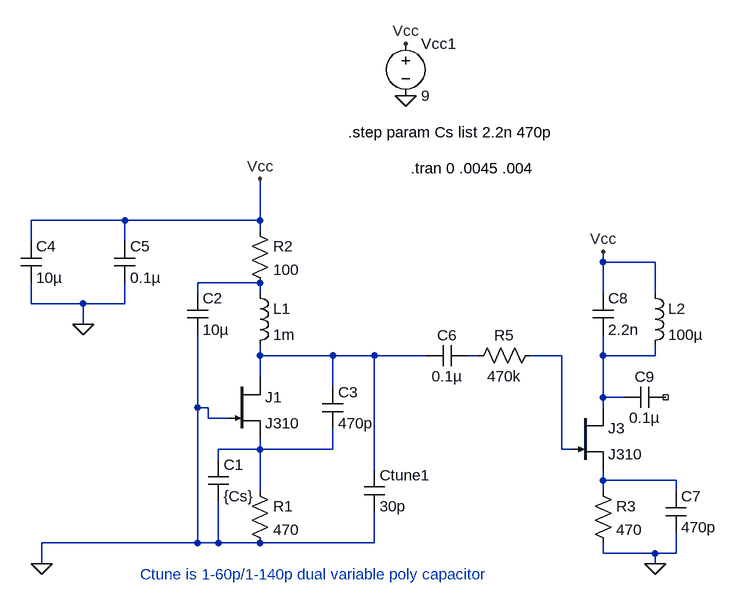
[diagram p0: schematic OscillatorToFix.asc]
OscillatorToFix.asc, the LTspice schematic file:
Version 4
SHEET 1 880 680
WIRE -128 16 -272 16
WIRE 80 16 80 -48
WIRE 80 16 -128 16
WIRE 80 32 80 16
WIRE -272 48 -272 16
WIRE -128 48 -128 16
WIRE 608 80 608 64
WIRE 688 80 608 80
WIRE 80 112 -16 112
WIRE -16 128 -16 112
WIRE 80 128 80 112
WIRE 608 128 608 80
WIRE 688 128 688 80
WIRE -272 144 -272 112
WIRE -192 144 -272 144
WIRE -128 144 -128 112
WIRE -128 144 -192 144
WIRE -192 176 -192 144
WIRE 80 224 80 208
WIRE 192 224 80 224
WIRE 256 224 192 224
WIRE 336 224 256 224
WIRE 416 224 400 224
WIRE 544 224 496 224
WIRE 608 224 608 192
WIRE 688 224 688 208
WIRE 688 224 608 224
WIRE 80 256 80 224
WIRE 192 272 192 224
WIRE 608 288 608 224
WIRE 640 288 608 288
WIRE -16 304 -16 192
WIRE 0 304 -16 304
WIRE 608 304 608 288
WIRE 0 320 0 304
WIRE 32 320 0 320
WIRE 80 368 80 352
WIRE 80 368 16 368
WIRE 192 368 192 336
WIRE 192 368 80 368
WIRE 544 368 544 224
WIRE 560 368 544 368
WIRE 16 384 16 368
WIRE 256 400 256 224
WIRE 608 416 608 400
WIRE 720 416 608 416
WIRE 80 432 80 368
WIRE 608 432 608 416
WIRE 720 432 720 416
WIRE -16 512 -16 304
WIRE -16 512 -256 512
WIRE 16 512 16 448
WIRE 16 512 -16 512
WIRE 80 512 16 512
WIRE 256 512 256 464
WIRE 256 512 80 512
WIRE 608 528 608 512
WIRE 688 528 608 528
WIRE 720 528 720 496
WIRE 720 528 688 528
WIRE -256 544 -256 512
WIRE 688 544 688 528
FLAG 304 -176 0
FLAG 304 -256 Vcc
FLAG 80 -48 Vcc
FLAG -256 544 0
FLAG -192 176 0
FLAG 688 544 0
FLAG 608 64 Vcc
SYMBOL voltage 304 -272 R0
WINDOW 123 0 0 Left 0
WINDOW 39 0 0 Left 0
SYMATTR InstName Vcc1
SYMATTR Value 9
SYMBOL res 64 416 R0
SYMATTR InstName R1
SYMATTR Value 470
SYMBOL cap 0 384 R0
SYMATTR InstName C1
SYMATTR Value {Cs}
SYMBOL cap -32 128 R0
SYMATTR InstName C2
SYMATTR Value 10µ
SYMBOL njf 32 256 R0
SYMATTR InstName J1
SYMATTR Value J310
SYMBOL ind 64 112 R0
SYMATTR InstName L1
SYMATTR Value 1m
SYMBOL res 64 16 R0
SYMATTR InstName R2
SYMATTR Value 100
SYMBOL cap 176 272 R0
SYMATTR InstName C3
SYMATTR Value 470p
SYMBOL cap 240 400 R0
SYMATTR InstName Ctune1
SYMATTR Value 30p
SYMBOL cap -288 48 R0
SYMATTR InstName C4
SYMATTR Value 10µ
SYMBOL cap -144 48 R0
SYMATTR InstName C5
SYMATTR Value 0.1µ
SYMBOL cap 400 208 R90
WINDOW 0 0 32 VBottom 2
WINDOW 3 32 32 VTop 2
SYMATTR InstName C6
SYMATTR Value 0.1µ
SYMBOL njf 560 304 R0
SYMATTR InstName J3
SYMATTR Value J310
SYMBOL res 592 416 R0
SYMATTR InstName R3
SYMATTR Value 470
SYMBOL cap 704 432 R0
SYMATTR InstName C7
SYMATTR Value 470p
SYMBOL cap 592 128 R0
SYMATTR InstName C8
SYMATTR Value 2.2n
SYMBOL ind 672 112 R0
SYMATTR InstName L2
SYMATTR Value 100µ
SYMBOL cap 704 272 R90
WINDOW 0 0 32 VBottom 2
WINDOW 3 32 32 VTop 2
SYMATTR InstName C9
SYMATTR Value 0.1µ
SYMBOL res 512 208 R90
WINDOW 0 0 56 VBottom 2
WINDOW 3 32 56 VTop 2
SYMATTR InstName R5
SYMATTR Value 470k
TEXT -104 560 Left 2 ;Ctune is 1-60p/1-140p dual variable poly capacitor
TEXT 312 -64 Left 2 !.tran 0 .0045 .004
TEXT 216 -120 Left 2 !.step param Cs list 2.2n 470p

The netlist it stands for:
* OscillatorToFix.asc
Vcc1 Vcc 0 9
R1 N006 0 470
C1 N006 0 {Cs}
C2 N001 0 10µ
J1 N002 0 N006 J310
L1 N001 N002 1m
R2 Vcc N001 100
C3 N002 N006 470p
Ctune1 N002 0 30p
C4 Vcc 0 10µ
C5 Vcc 0 0.1µ
C6 N003 N002 0.1µ
J3 N005 N004 N007 J310
R3 N007 0 470
C7 N007 0 470p
C8 Vcc N005 2.2n
L2 Vcc N005 100µ
C9 NC_01 N005 0.1µ
R5 N004 N003 470k
.model NJF NJF
.model PJF PJF
.lib standard.jft
* Ctune is 1-60p/1-140p dual variable poly capacitor
.tran 0 .0045 .004
.step param Cs list 2.2n 470p
.backanno
.end